# EAGLE design LNA-SMA (EAGLE 7.2.0)
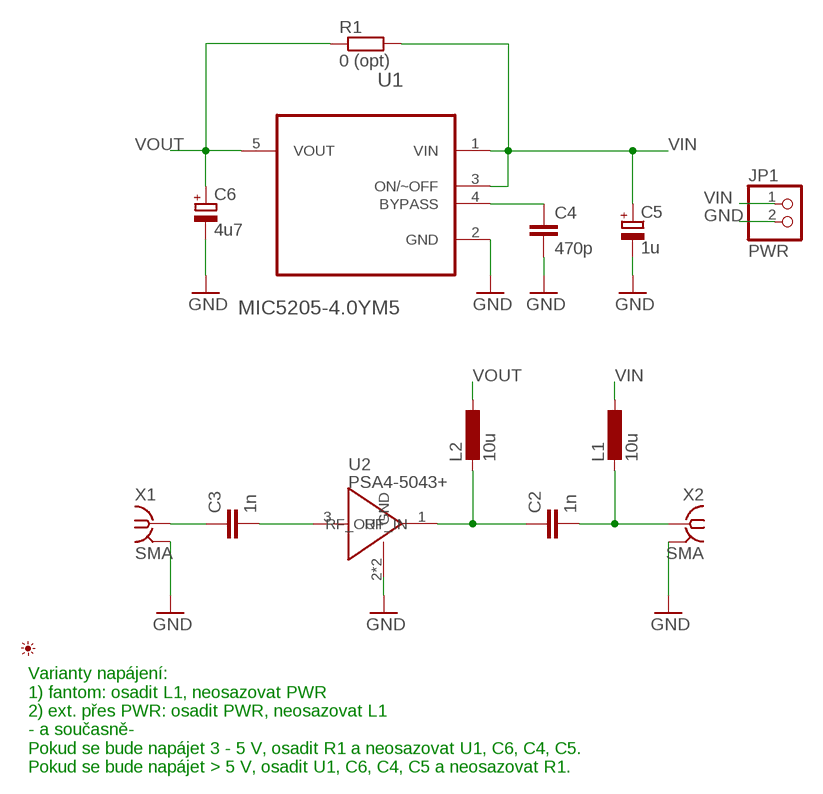
[diagram p0: schematic, sheet 1]

## Parts
C2  1n  C-EUC0603  [C0603]
C3  1n  C-EUC0603  [C0603]
C4  470p  C-EUC0603  [C0603]
C5  1u  CPOL-EUSMCA  [SMC_A]
C6  4u7  CPOL-EUSMCA  [SMC_A]
JP1  PWR  PINHD-1X2  [1X02]
L1  10u  L-EUL2012C  [L2012C]
L2  10u  L-EUL2012C  [L2012C]
R1  0 (opt)  R-EU_R0603  [R0603]
U1  MIC5205-4.0YM5  LP2985A-18DBVJ  [SOT95P280X145-5N]
U2  PSA4-5043+  [INF-SOT343_V_1PRIMARY]
U$1  PICTO_1  [PICTO_1]
X1  SMA  SMA-142-0701-801/806  [J502-ND-142-0701-801/806]
X2  SMA  SMA-142-0701-801/806  [J502-ND-142-0701-801/806]

## Nets
GND: C4.2 C5.- C6.- JP1.2 U1.2(GND) U2.2(GND) U2.4(GND) X1.G@1 X1.G@2 X1.G@3 X1.G@4 X2.G@1 X2.G@2 X2.G@3 X2.G@4
N$1 [net]: C4.1 U1.4(BYPASS)
N$2 [RF]: C3.2 U2.3(RF_IN)
N$3 [RF]: C2.1 L2.2 U2.1(RF_OUT)
RF_IN [RF]: C2.2 L1.2 X2.1
RF_OUT [RF]: C3.1 X1.1
VIN [net]: C5.+ JP1.1 L1.1 R1.2 U1.1(VIN) U1.3(ON/~OFF)
VOUT [net]: C6.+ L2.1 R1.1 U1.5(VOUT)

## Notes on the sheet
- Varianty napájení:
  1) fantom: osadit L1, neosazovat PWR
  2) ext. přes PWR: osadit PWR, neosazovat L1
  - a současně-
  Pokud se bude napájet 3 - 5 V, osadit R1 a neosazovat U1, C6, C4, C5.
  Pokud se bude napájet > 5 V, osadit U1, C6, C4, C5 a neosazovat R1.

## Library data of the parts
C2-C4 = rcl:C-EU: CAPACITOR, European symbol
C5 C6 = rcl:CPOL-EU: POLARIZED CAPACITOR, European symbol
JP1 = pinhead:PINHD-1X2: PIN HEADER
L1 L2 = rcl:L-EU: INDUCTOR, European symbol
R1 = rcl:R-EU_: RESISTOR, European symbol
U1 = Texas Instruments_By_element14_Batch_1:LP2985A-18DBVJ: 150-mA LOW-NOISE LOW-DROPOUT REGULATOR; MPN: LP2985A-18DBVJ; OC_FARNELL: 1924808; OC_NEWARK: 58T1987; PACKAGE: SOT-23-5; SUPPLIER: Texas Instruments
U2 = INF-SOT343_V:PSA4-5043+: Mini-Circuits PSA4-5043+
U$1 = My_Picto:PICTO_1: Zdenek Brichacek; OK3ZB; http://blog.brichacek.net
X1 X2 = con-coax:SMA-: SMA 50 Ohm End Launch Jack Receptacle - Round Contact Johnson Components Source: www.johnsoncomponents.com .. J502-ND.pdf; MF: JOHNSON COMPONENTS; MPN: 142-0701-801; OC_FARNELL: 1608592; OC_NEWARK: 90F2624

## Net classes
1 RF: width 2.5 mm, clearance 0.508 mm
2 net: width 0.6 mm, clearance 0.254 mm

## Board
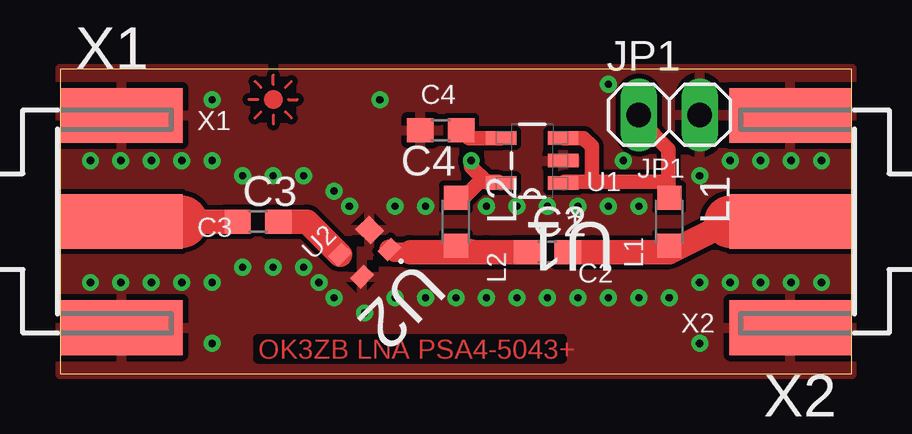
[diagram p1: board, top side]
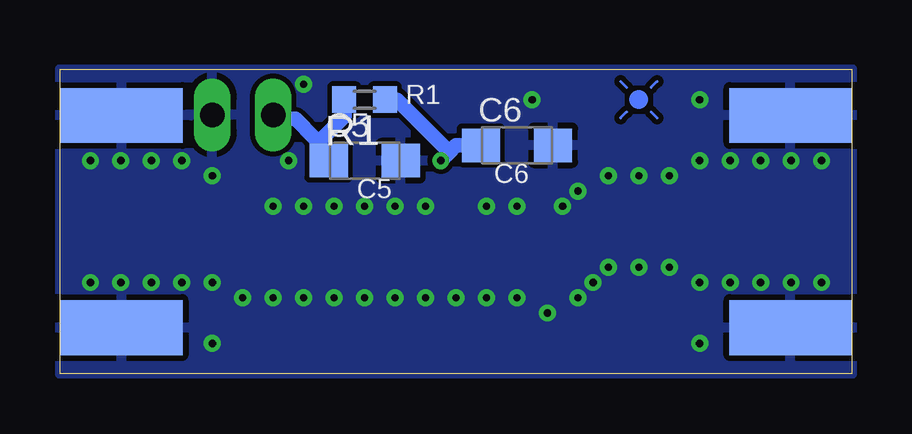
[diagram p2: board, bottom side, seen from below]

Size 33.02 x 12.7 mm. Coordinates in mm from the lower left corner, seen from the top.
Outline: 0,0 33,0 33,12.7 0,12.7 0,0
Copper layers (1*16): Top 0.035mm / dielectric 1.5mm / Bottom 0.035mm
Design rules "default *": minimum track width 10mil, minimum drill 24mil, track to track 8mil, track to pad 8mil, pad to pad 8mil, via to via 8mil, smd to smd 8mil, copper to edge 0mil, drill to drill 8mil, minimum pad ring 10mil, minimum via ring 8mil, stop-mask expansion 4mil, vias tented up to drill 0mil, thermal gap 10mil

### Footprints (pad centres in the part's own frame; a part is rotated, then mirrored left to right if it is on the bottom)
C0603 = smd 1.1 x 1: 1 -0.85,0; 2 0.85,0
SMC_A = smd 1.6 x 1.4: + -1.5,0; - 1.5,0
1X02 = drill 1.016 long: 1 -1.27,0; 2 1.27,0
L2012C = smd 1 x 1: 1 -1,0; 2 1,0
R0603 = smd 1 x 1.1: 1 -0.85,0; 2 0.85,0
SOT95P280X145-5N = smd 1.27 x 0.559: 1 -1.295,0.94; 2 -1.295,0; 3 -1.295,-0.94; 4 1.295,-0.94; 5 1.295,0.94
INF-SOT343_V_1PRIMARY = smd 0.8 x 0.6: 1 -0.8,0.65; 3 0.8,-0.65; 4 0.8,0.65 | smd 0.8 x 0.9: 2 -0.8,-0.5
J502-ND-142-0701-801/806 = smd 5.08 x 2.286: 1 2.565,0; G@1 2.565,4.42; G@2 2.565,-4.42 | smd 5.08 x 2.286 bottom: G@3 2.565,4.42; G@4 2.565,-4.42

### Placement (x,y rotation side)
C2  20.32,5.08 0 top
C3  8.26,6.35 0 top
C4  15.88,10.16 180 top
C5  20.32,8.89 0 bottom
C6  13.97,9.53 0 bottom
JP1  25.4,10.79 0 top
L1  25.4,6.35 270 top
L2  16.51,6.35 270 top
R1  20.32,11.43 180 bottom
U1  19.68,8.89 180 top
U2  12.7,5.08 225 top
U$1  8.89,11.43 0 top
X1  0,6.35 0 top
X2  33.02,6.35 180 top

### Tracks (layer width: path | path; a pad name or v marks a point on that pad's centre or on a via)
GND  (via drill 0.3)
  other vias: 2.54,3.81 5.08,3.81 7.62,4.45 10.16,4.45 11.43,3.17 12.7,2.54 13.97,3.17 15.24,3.17 17.78,3.17 20.32,3.17 22.86,3.17 25.4,3.17 2.54,8.89 27.94,3.81 30.48,3.81 5.08,8.89 7.62,8.26 10.16,8.26 11.43,7.62 12.06,6.99 13.97,6.99 15.24,6.99 17.78,6.99 21.59,6.99 22.86,6.99 30.48,8.89 27.94,8.89 8.89,4.45 6.35,3.81 3.81,3.81 1.27,3.81 1.27,8.89 3.81,8.89 6.35,8.89 8.89,8.26 16.51,3.17 19.05,3.17 19.05,6.99 21.59,3.17 10.79,3.81 24.13,3.17 26.67,3.81 29.21,3.81 31.75,3.81 31.75,8.89 29.21,8.89 6.35,11.43 6.35,1.27 26.67,1.27 24.13,6.99 20.32,6.99 26.67,8.26 22.86,12.06 23.5,8.89 13.34,11.43
  pour Top: 0,12.7 0,0 33.02,0 33.02,12.7
  pour Bottom: 0,12.7 0,0 33.02,0 33.02,12.7
N$1
  Top 0.61: U1.4 17.05,9.83 C4.1
N$2
  Top 1.016: C3.2 10.3,6.35 U2.3
N$3
  Top 0.813: U2.1 13.97,5.08 14.61,5.08 | L2.2 17.78,5.08
  Top 1.016: 14.61,5.08 17.78,5.08 C2.1
RF_IN
  Top 0.813: L1.2 25.4,5.08
  Top 1.016: C2.2 22.23,5.08 25.4,5.08 27.94,6.35
  Top 2.184: 27.94,6.35 X2.1
RF_OUT
  Top 1.016: 5.08,6.35 C3.1
  Top 2.184: X1.1 5.08,6.35
VIN
  Top 0.6: 25.38,8 25.38,9.37 24.23,10.52 24.23,10.74 JP1.1 | 25.38,8 25.38,7.43 L1.1 | 25.38,8 22.17,8 | 22.17,8 21.03,8 U1.1 | U1.3 21.83,9.83 22.17,9.49 22.17,8
  Bottom 0.6: 22.17,9.72 21.14,10.74 21.14,11.43 R1.2 | 22.17,9.72 22.17,9.26 21.83,8.91 C5.+ | 22.17,9.72 22.4,9.83 23.2,10.63 24,10.63 24.12,10.74 JP1.1
VOUT  (via drill 0.3)
  Top 0.6: 17.78,8 18.29,8 U1.5 | 17.78,8 17.49,8 16.92,7.43 16.57,7.43 L2.1 | v17.14,8.89 17.14,8.64 17.78,8
  Bottom 0.6: 15.43,9.6 C6.+ 16.51,9.53 16.79,9.25 | 16.79,9.25 v17.14,8.89 | R1.1 18.97,11.43 16.79,9.25

### Text on the board
Top: OK3ZB LNA PSA4-5043+
_tNames: C4 | X1 | U1 | JP1 | C3 | L1 | U2 | L2 | C2 | X2
_bNames: R1 | C6 | C5